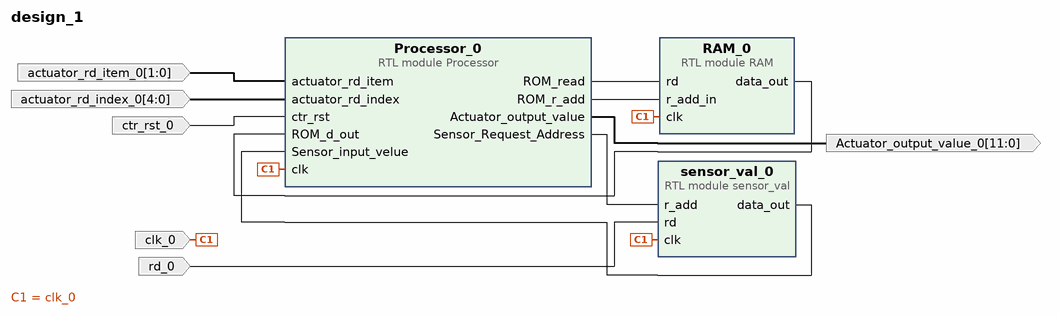
[diagram p0: block diagram of the top level]
# Vivado block design design_1, xc7z020clg484-1, Vivado 2019.2
create_bd_design design_1

create_bd_port -dir I -type clk clk_0
create_bd_port -dir I -from 1 -to 0 actuator_rd_item_0
create_bd_port -dir I -from 4 -to 0 actuator_rd_index_0
create_bd_port -dir O -from 11 -to 0 Actuator_output_value_0
create_bd_port -dir I -type rst ctr_rst_0
create_bd_port -dir I rd_0

create_bd_cell -type module -reference Processor Processor_0
create_bd_cell -type module -reference sensor_val sensor_val_0
create_bd_cell -type module -reference RAM RAM_0

# ---- connections ----

connect_bd_net -net clk_0_1 [get_bd_ports clk_0] [get_bd_pins Processor_0/clk] [get_bd_pins sensor_val_0/clk] [get_bd_pins RAM_0/clk]
connect_bd_net [get_bd_pins RAM_0/data_out] [get_bd_pins Processor_0/ROM_d_out]
connect_bd_net -net actuator_rd_item_0_1 [get_bd_ports actuator_rd_item_0] [get_bd_pins Processor_0/actuator_rd_item]
connect_bd_net -net actuator_rd_index_0_1 [get_bd_ports actuator_rd_index_0] [get_bd_pins Processor_0/actuator_rd_index]
connect_bd_net [get_bd_pins sensor_val_0/data_out] [get_bd_pins Processor_0/Sensor_input_velue]
connect_bd_net [get_bd_pins Processor_0/Sensor_Request_Address] [get_bd_pins sensor_val_0/r_add]
connect_bd_net [get_bd_pins Processor_0/ROM_read] [get_bd_pins RAM_0/rd]
connect_bd_net [get_bd_pins Processor_0/ROM_r_add] [get_bd_pins RAM_0/r_add_in]
connect_bd_net [get_bd_pins Processor_0/Actuator_output_value] [get_bd_ports Actuator_output_value_0]
connect_bd_net -net ctr_rst_0_1 [get_bd_ports ctr_rst_0] [get_bd_pins Processor_0/ctr_rst]
connect_bd_net -net rd_0_1 [get_bd_ports rd_0] [get_bd_pins sensor_val_0/rd]

validate_bd_design
save_bd_design
